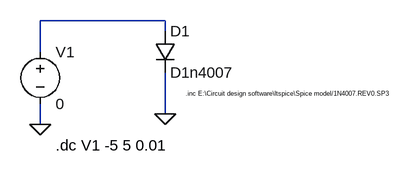
[diagram p0: schematic diode_charactaristic.asc]
diode_charactaristic.asc, the LTspice schematic file:
Version 4
SHEET 1 964 680
WIRE 208 112 16 112
WIRE 208 128 208 112
WIRE 16 160 16 112
WIRE 208 256 208 192
WIRE 16 272 16 240
FLAG 208 256 0
FLAG 16 272 0
SYMBOL voltage 16 144 R0
WINDOW 123 0 0 Left 0
WINDOW 39 0 0 Left 0
SYMATTR InstName V1
SYMATTR Value 0
SYMBOL diode 192 128 R0
SYMATTR InstName D1
SYMATTR Value D1n4007
TEXT 40 304 Left 2 !.dc V1 -5 5 0.01
TEXT 240 224 Left 0 !.inc E:\\Circuit design software\\ltspice\\Spice model/1N4007.REV0.SP3

The netlist it stands for:
* diode_charactaristic.asc
V1 N001 0 0
D1 N001 0 D1n4007
.model D D
.lib standard.dio
.dc V1 -5 5 0.01
.inc E:\Circuit design software\ltspice\Spice model/1N4007.REV0.SP3
.backanno
.end